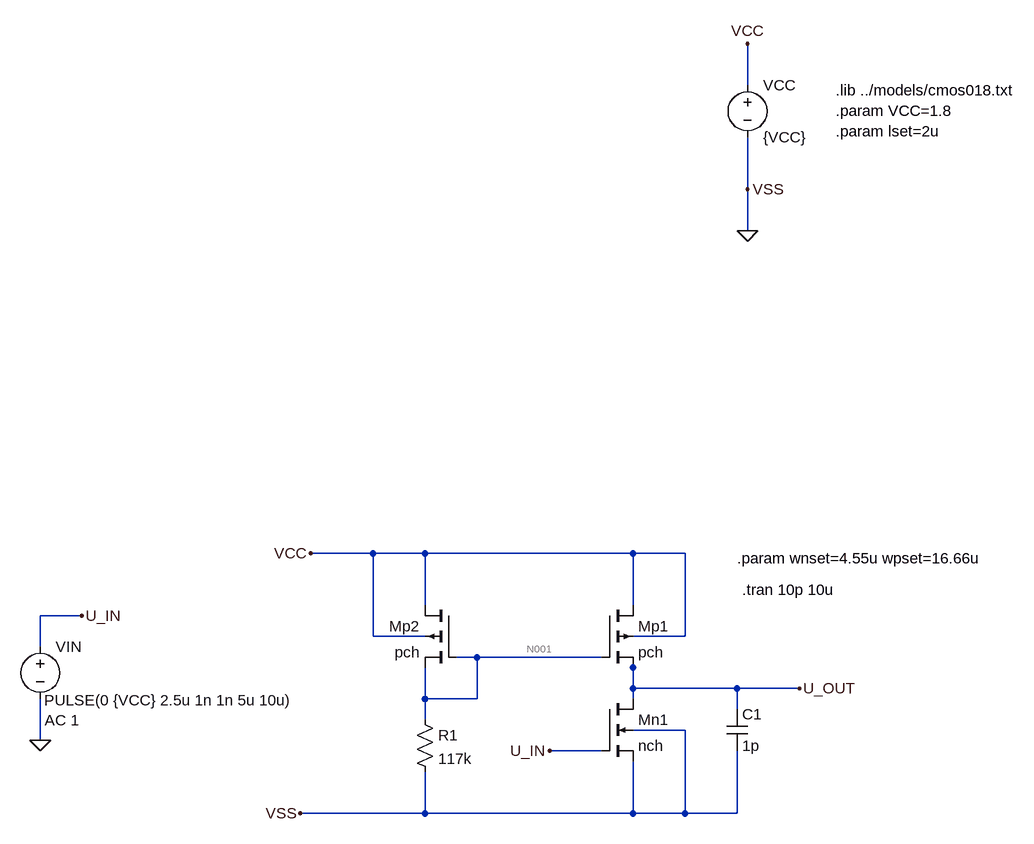
[diagram p0: schematic 4-2-3.asc]
4-2-3.asc, the LTspice schematic file:
Version 4
SHEET 1 7274800 2004
WIRE 1072 -544 1072 -608
WIRE 1072 -384 1072 -464
WIRE 1072 -320 1072 -384
WIRE 496 176 400 176
WIRE 576 176 496 176
WIRE 896 176 576 176
WIRE 976 176 896 176
WIRE 576 256 576 176
WIRE 896 256 896 176
WIRE 48 272 -16 272
WIRE 496 304 496 176
WIRE 576 304 496 304
WIRE 976 304 976 176
WIRE 976 304 896 304
WIRE -16 320 -16 272
WIRE 656 336 624 336
WIRE 848 336 656 336
WIRE 896 352 896 336
WIRE 896 384 896 352
WIRE 1056 384 896 384
WIRE 1152 384 1056 384
WIRE 576 400 576 352
WIRE 656 400 656 336
WIRE 656 400 576 400
WIRE 896 400 896 384
WIRE 1056 416 1056 384
WIRE 576 432 576 400
WIRE 976 448 896 448
WIRE -16 464 -16 400
WIRE 848 480 768 480
WIRE 576 576 576 512
WIRE 576 576 384 576
WIRE 896 576 896 496
WIRE 896 576 576 576
WIRE 976 576 976 448
WIRE 976 576 896 576
WIRE 1056 576 1056 480
WIRE 1056 576 976 576
FLAG 1072 -320 0
FLAG 1072 -608 VCC
FLAG 400 176 VCC
FLAG 384 576 VSS
FLAG 1072 -384 VSS
FLAG 1152 384 U_OUT
FLAG 768 480 U_IN
FLAG 48 272 U_IN
FLAG -16 464 0
SYMBOL voltage 1072 -560 R0
WINDOW 123 0 0 Left 0
WINDOW 39 0 0 Left 0
SYMATTR InstName VCC
SYMATTR Value {VCC}
SYMBOL nmos4 848 400 R0
SYMATTR InstName Mn1
SYMATTR Value nch
SYMATTR Value2 l=lset w=wnset
SYMBOL res 560 416 R0
SYMATTR InstName R1
SYMATTR Value 117k
SYMBOL cap 1040 416 R0
SYMATTR InstName C1
SYMATTR Value 1p
SYMBOL voltage -16 304 R0
WINDOW 123 7 129 Left 2
WINDOW 39 0 0 Left 0
WINDOW 3 6 98 Left 2
SYMATTR Value2 AC 1
SYMATTR Value PULSE(0 {VCC} 2.5u 1n 1n 5u 10u)
SYMATTR InstName VIN
SYMBOL pmos4 848 256 R0
SYMATTR InstName Mp1
SYMATTR Value pch
SYMATTR Value2 l=lset w=wpset
SYMBOL pmos4 624 256 M0
SYMATTR InstName Mp2
SYMATTR Value pch
SYMATTR Value2 l=lset w=wpset
TEXT 1208 -536 Left 2 !.lib ../models/cmos018.txt\n.param VCC=1.8\n.param lset=2u
TEXT 1056 184 Left 2 !.param wnset=4.55u wpset=16.66u
TEXT 1064 232 Left 2 !.tran 10p 10u

The netlist it stands for:
* 4-2-3.asc
VCC VCC 0 {VCC}
Mn1 U_OUT U_IN 0 0 nch l=lset w=wnset
R1 N001 0 117k
C1 U_OUT 0 1p
VIN U_IN 0 PULSE(0 {VCC} 2.5u 1n 1n 5u 10u) AC 1
Mp1 VCC N001 U_OUT VCC pch l=lset w=wpset
Mp2 VCC N001 N001 VCC pch l=lset w=wpset
.model NMOS NMOS
.model PMOS PMOS
.lib standard.mos
.lib ../models/cmos018.txt
.param VCC=1.8
.param lset=2u
.param wnset=4.55u wpset=16.66u
.tran 10p 10u
.backanno
.end

* Results of the author's LTspice run, read from the files saved beside the schematic
* Operating Point, zero values left out:
*   V(vcc) = 1.8 V
*   V(u_out) = 1.8 V
*   V(n001) = 1.19 V
*   Id(Mn1) = 19.48 pA
*   Ib(Mn1) = -1.81 pA
*   Is(Mn1) = -17.67 pA
*   Id(Mp1) = -80.77 pA
*   Is(Mp1) = 80.77 pA
*   Id(Mp2) = 10.17 µA
*   Is(Mp2) = -10.17 µA
*   I(R1) = 10.17 µA
*   I(Vcc) = -10.17 µA
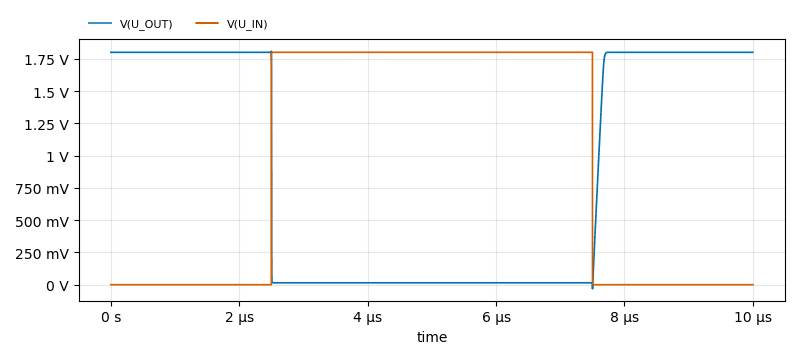
[diagram p1: Transient Analysis of 4-2-3.asc, plotted from the saved traces]
* Transient Analysis, 1 run:
*   V(U_OUT): min -32.09 mV, max 1.808 V, average 891.4 mV, rms 1.258 V, last 1.8 V
*   V(U_IN): min 0 V, max 1.8 V, average 900.2 mV, rms 1.273 V, last 0 V